# Altium schematic sheet SHDN-S04-V00-ShutdownRelay.SchDoc: Shutdown Loop Termination & Latching Relay
size A3; DrawnBy: Jonn Dillon; DocumentNumber: 9; SheetNumber: 9; SheetTotal: 11; Project: Shutdown Board 2020
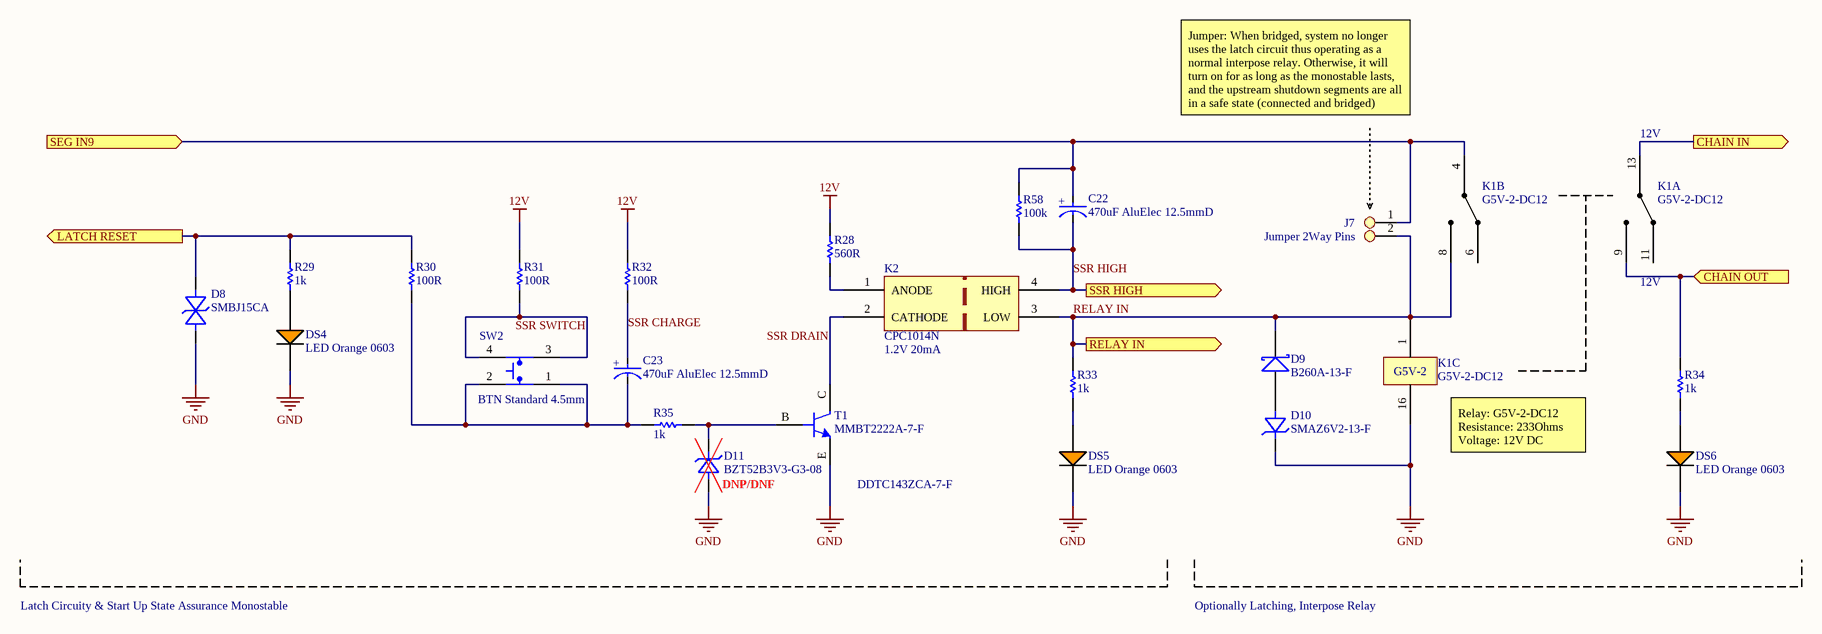
[diagram p0: SHDN-S04-V00-ShutdownRelay.SchDoc]

## Parts
C22  470uF AluElec 12.5mmD  [CAL_ALU_12.5mmD_20mmL]
C23  470uF AluElec 12.5mmD  [CAL_ALU_12.5mmD_20mmL]
D8  SMBJ15CA  [SMB]
D9  B260A-13-F  [SMA]
D10  SMAZ6V2-13-F  [SMA]
D11  BZT52B3V3-G3-08  [SOD123]
DS4  LED Orange 0603  [LED ORANGE 0603]
DS5  LED Orange 0603  [LED ORANGE 0603]
DS6  LED Orange 0603  [LED ORANGE 0603]
J7  Jumper 2Way Pins  [Jumper_2Way_Pin]
K1  G5V-2-DC12  [G5V-2]  (parts A,B,C of 3)
K2  CPC1014N  [CPC1014N]
R28  560R  [Res_ThinFilm_0603]
R29  1k  [Res_ThinFilm_0603]
R30  100R  [Res_ThinFilm_0603]
R31  100R  [Res_ThinFilm_0603]
R32  100R  [Res_ThinFilm_0603]
R33  1k  [Res_ThinFilm_0603]
R34  1k  [Res_ThinFilm_0603]
R35  1k  [Res_ThinFilm_0603]
R58  100k  [Res_ThinFilm_0603]
SW2  BTN Standard 4.5mm  [BTN STANDARD 4.5mm X 4.5mm]
T1  MMBT2222A-7-F  [SOT23-3 - Transistor]

## Ports
CHAIN IN (out), CHAIN OUT (in), LATCH RESET (out), RELAY IN (out), SEG IN9 (in), SSR HIGH (out)

## Nets
12V: R28.1 R31.2 R32.2
GND: D8.A(Anode) D10.K(Cathode) D11.A(Anode) DS4.2(C) DS5.2(C) DS6.2(C) K1.16 T1.E
CHAIN IN: K1.13 ; port CHAIN IN
CHAIN OUT: K1.9 R34.2 ; port CHAIN OUT
LATCH RESET: D8.K(Cathode) R29.2 R30.2 ; port LATCH RESET
RELAY IN: D9.K J7.2 K1.1 K1.8 K2.3(LOW) R33.2 ; port RELAY IN
SEG IN9: C22.A J7.1 K1.4 R58.2 ; port SEG IN9
SSR CHARGE: C23.A R32.1
SSR DRAIN: K2.2(CATHODE) T1.C
SSR HIGH: C22.K K2.4(HIGH) R58.1 ; port SSR HIGH
SSR SWITCH: R31.1 SW2.3 SW2.4
NetC23_K: C23.K R30.1 R35.1 SW2.1 SW2.2
NetD9_A: D9.A D10.A(Anode)
NetD11_K: D11.K(Cathode) R35.2 T1.B
NetDS4_1: DS4.1(A) R29.1
NetDS5_1: DS5.1(A) R33.1
NetDS6_1: DS6.1(A) R34.1
NetK2_1: K2.1(ANODE) R28.2

Not connected (* = marked no-connect by the designer): K1 6 11

## Notes on the sheet
- Jumper: When bridged, system no longer uses the latch circuit thus operating as a normal interpose relay. Otherwise, it will turn on for as long as the monostable lasts, and the upstream shutdown segments are all in a safe state (connected and bridged)
- (near K1) 12V
- (near K2) 1.2V 20mA
- (near D11) DNP/DNF
- (near T1) DDTC143ZCA-7-F
- (near K1) Relay: G5V-2-DC12
  Resistance: 233Ohms
  Voltage: 12V DC
- Latch Circuity & Start Up State Assurance Monostable
- Optionally Latching, Interpose Relay
- Revision History:
- Sheet Title:
- Rev
- Date
- Description
- Project:
- Size:
- Drawn By:
- A3
- Number:
- Revision:
- Sheet
- Version:
- of
- QUT Motorsport
- O-120, Gardens Point
- 2 George Street
- Brisbane, QLD 4000
- Australia
- Print Date:
- Print Time:
- File Name:
- (in symbol 470uF 50V 20% AluElec 12.5mmD) +
- (in symbol G5V-2-DC12, part C) G5V-2

## Library data of the parts
C22 C23 = 470uF 50V 20% AluElec 12.5mmD: Capacitor, AluElec, SMD, 470F, 50V, 20%, AluElec, 12.5mmD
D8 = SMBJ15CA: Diode, SMD, TVS Diode, 15V 24.4V, DO214AA/SMB; ComponentLink1Description: Digikey; ComponentLink1URL: https://www.digikey.com.au/product-detail/en/littelfuse-inc/SMBJ15CA/SMBJ15CALFCT-ND/285983; ComponentLink2Description: Datasheet; ComponentLink2URL: https://www.littelfuse.com/~/media/electronics/datasheets/tvs_diodes/littelfuse_tvs_diode_smbj_datasheet.pdf.pdf
D9 = B260A-13-F: Diode, Schottky Barrier Rectifier, 60 V, 2 A, B260A-13-F
D10 = SMAZ6V2-13-F: Zener Diode 6.2V 1W ±5% Surface Mount SMA; Manufacturer: Generic; MPN: 5V6 500mW SMA
D11 = BZT52B3V3-G3-08: Diode, SMD, Zenner, 3.3V, 2%, 410mW, SOD-123; ComponentLink1Description: Digikey; ComponentLink1URL: https://www.digikey.com.au/product-detail/en/vishay-semiconductor-diodes-division/BZT52B3V3-G3-08/BZT52B3V3-G3-08GICT-ND/8284035; ComponentLink2Description: Datasheet; ComponentLink2URL: https://www.vishay.com/docs/83340/bzt52g.pdf
J7 = Jumper 2Way Side Pins
K1 = G5V-2-DC12: General Purpose Relay DPDT (2 Form C) Through Hole, 12V, 2A
K2 = CPC1014N: Solid State SPST-NO (1 Form A) 4-SOP (0.150", 3.81mm)
R28 = 560R 5% 0603: Resistor, SMD, 560R, 0.1W, 5%, 0603
R29 R33-R35 = 1k 5% 0603: Resistor, SMD, 1k, 0.1W, 5%, 0603
R30-R32 = 100R 5%, 0603: Resistor, SMD, 100R, 0.1W, 5%, 0603
R58 = 100k 5%, 0603: Resistor, SMD, 100k, 0.1W, 5%, 0603
SW2 = BTN Standard 4.5mm: Standard 4.5mm X 4.5mm momentary button; ComponentLink1Description: LCSC; ComponentLink1URL: https://lcsc.com/product-detail/Tactile-Switches_BRIGHT-TSA063G50-250_C294565.html
T1 = MMBT2222A-7-F: Bipolar (BJT) Transistor NPN 40V 600mA 300MHz 310mW Surface Mount SOT-23-3; ComponentLink1Description: Digikey; ComponentLink1URL: https://www.digikey.com.au/product-detail/en/diodes-incorporated/DDTC143ZCA-7-F/DDTC143ZCA-FDICT-ND/815626; ComponentLink2Description: Datasheet; ComponentLink2URL: https://www.diodes.com/assets/Datasheets/ds30330.pdf